# Altium schematic sheet VALVEBOARD_PostIsolation.SchDoc
size A4; SheetNumber: 5; SheetTotal: 8
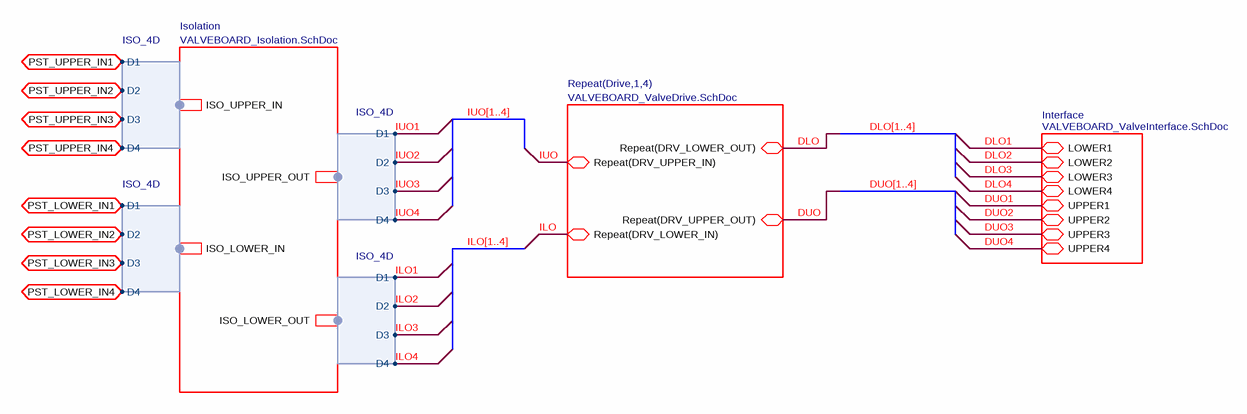
[diagram p0: VALVEBOARD_PostIsolation.SchDoc]

## Sub-sheets
Interface = VALVEBOARD_ValveInterface.SchDoc: LOWER1 (bidir), LOWER2 (bidir), LOWER3 (bidir), LOWER4 (bidir), UPPER1 (bidir), UPPER2 (bidir), UPPER3 (bidir), UPPER4 (bidir)
Isolation = VALVEBOARD_Isolation.SchDoc: ISO_UPPER_IN (harness ISO_4D), ISO_UPPER_OUT (harness ISO_4D), ISO_LOWER_IN (harness ISO_4D), ISO_LOWER_OUT (harness ISO_4D)
Repeat(Drive,1,4) = VALVEBOARD_ValveDrive.SchDoc: Repeat(DRV_UPPER_IN) (bidir), Repeat(DRV_LOWER_IN) (bidir), Repeat(DRV_UPPER_OUT) (bidir), Repeat(DRV_LOWER_OUT) (bidir)

## Ports
PST_LOWER_IN1 (bidir), PST_LOWER_IN2 (bidir), PST_LOWER_IN3 (bidir), PST_LOWER_IN4 (bidir), PST_UPPER_IN1 (bidir), PST_UPPER_IN2 (bidir), PST_UPPER_IN3 (bidir), PST_UPPER_IN4 (bidir)

## Harnesses
ISO_4D: D1, D2, D3, D4

## Nets
DLO: sheet Repeat(Drive,1,4)/Repeat(DRV_LOWER_OUT)
DLO1: sheet Interface/LOWER1
DLO2: sheet Interface/LOWER2
DLO3: sheet Interface/LOWER3
DLO4: sheet Interface/LOWER4
DUO: sheet Repeat(Drive,1,4)/Repeat(DRV_UPPER_OUT)
DUO1: sheet Interface/UPPER1
DUO2: sheet Interface/UPPER2
DUO3: sheet Interface/UPPER3
DUO4: sheet Interface/UPPER4
ILO: sheet Repeat(Drive,1,4)/Repeat(DRV_LOWER_IN)
ILO1: sheet Isolation/ISO_LOWER_OUT.D1
ILO2: sheet Isolation/ISO_LOWER_OUT.D2
ILO3: sheet Isolation/ISO_LOWER_OUT.D3
ILO4: sheet Isolation/ISO_LOWER_OUT.D4
IUO: sheet Repeat(Drive,1,4)/Repeat(DRV_UPPER_IN)
IUO1: sheet Isolation/ISO_UPPER_OUT.D1
IUO2: sheet Isolation/ISO_UPPER_OUT.D2
IUO3: sheet Isolation/ISO_UPPER_OUT.D3
IUO4: sheet Isolation/ISO_UPPER_OUT.D4
PST_LOWER_IN1: port PST_LOWER_IN1, sheet Isolation/ISO_LOWER_IN.D1
PST_LOWER_IN2: port PST_LOWER_IN2, sheet Isolation/ISO_LOWER_IN.D2
PST_LOWER_IN3: port PST_LOWER_IN3, sheet Isolation/ISO_LOWER_IN.D3
PST_LOWER_IN4: port PST_LOWER_IN4, sheet Isolation/ISO_LOWER_IN.D4
PST_UPPER_IN1: port PST_UPPER_IN1, sheet Isolation/ISO_UPPER_IN.D1
PST_UPPER_IN2: port PST_UPPER_IN2, sheet Isolation/ISO_UPPER_IN.D2
PST_UPPER_IN3: port PST_UPPER_IN3, sheet Isolation/ISO_UPPER_IN.D3
PST_UPPER_IN4: port PST_UPPER_IN4, sheet Isolation/ISO_UPPER_IN.D4

## Buses and harness runs
bus DLO[1..4]
bus DUO[1..4]
bus ILO[1..4]
bus IUO[1..4]